# Altium schematic sheet Motor.SchDoc
size A3; SheetNumber: 5; SheetTotal: 6
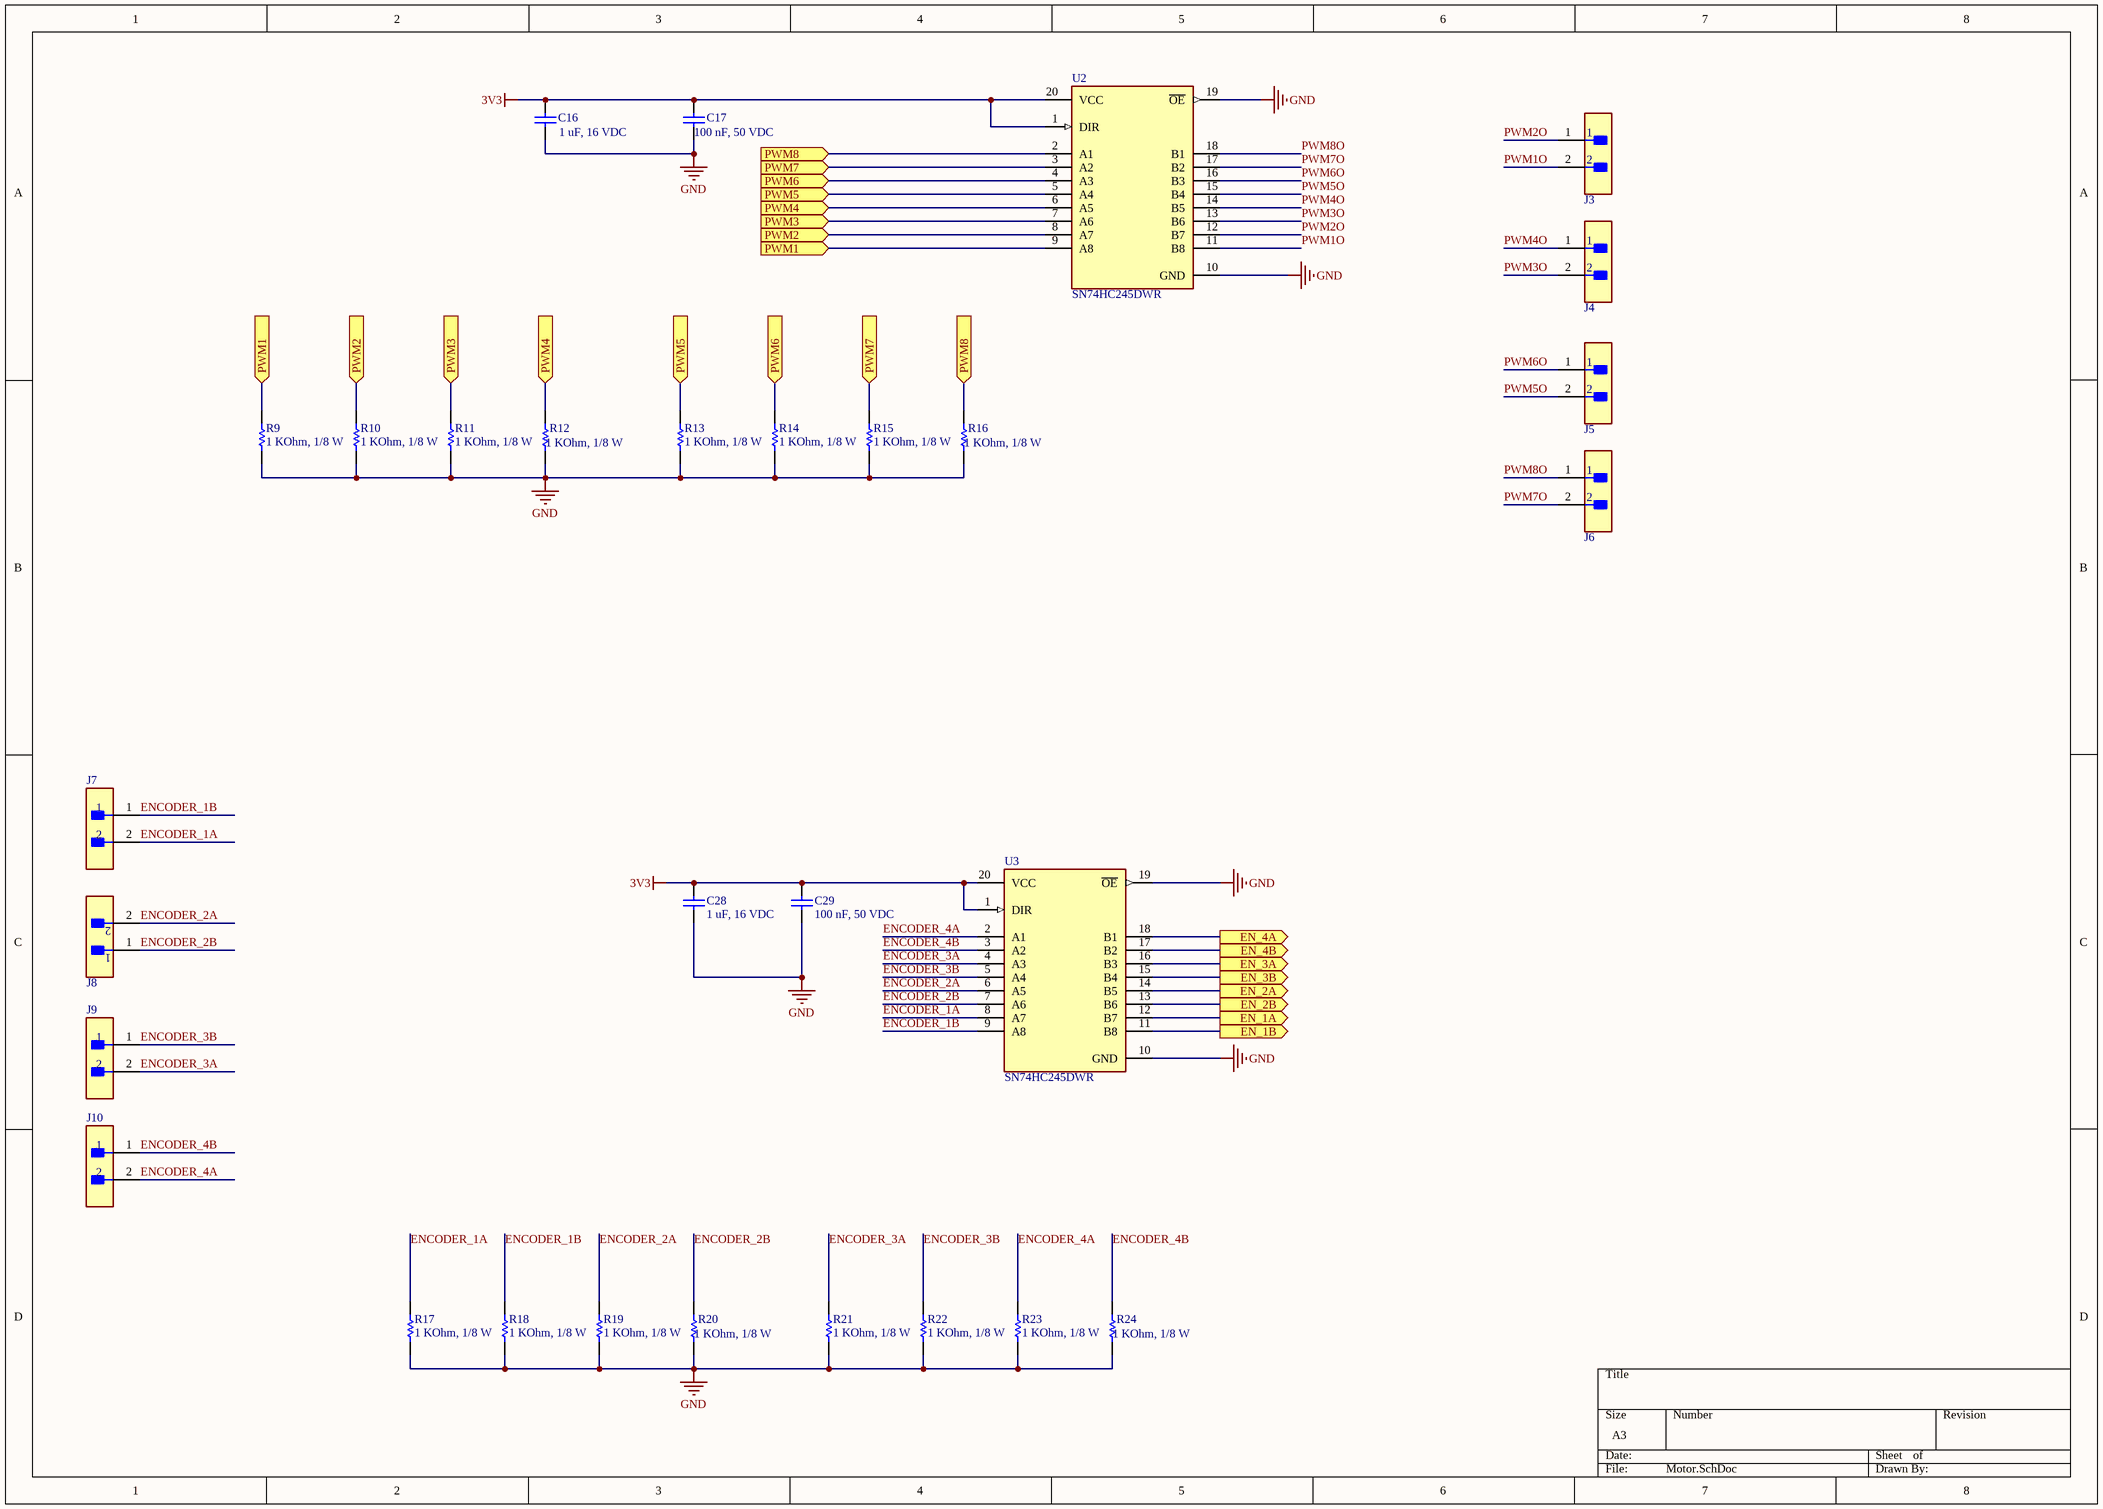
[diagram p0: Motor.SchDoc]

## Parts
C16  1 uF, 16 VDC  [CAP_0603]
C17  100 nF, 50 VDC  [CAP_0603]
C28  1 uF, 16 VDC  [CAP_0805]
C29  100 nF, 50 VDC  [CAP_0805]
J3  B2B-XH-A(LF)(SN)  [FP-B2B-XH-A_LF_SN-MFG]  (value not drawn)
J4  B2B-XH-A(LF)(SN)  [FP-B2B-XH-A_LF_SN-MFG]  (value not drawn)
J5  B2B-XH-A(LF)(SN)  [FP-B2B-XH-A_LF_SN-MFG]  (value not drawn)
J6  B2B-XH-A(LF)(SN)  [FP-B2B-XH-A_LF_SN-MFG]  (value not drawn)
J7  B2B-XH-A(LF)(SN)  [FP-B2B-XH-A_LF_SN-MFG]  (value not drawn)
J8  B2B-XH-A(LF)(SN)  [FP-B2B-XH-A_LF_SN-MFG]  (value not drawn)
J9  B2B-XH-A(LF)(SN)  [FP-B2B-XH-A_LF_SN-MFG]  (value not drawn)
J10  B2B-XH-A(LF)(SN)  [FP-B2B-XH-A_LF_SN-MFG]  (value not drawn)
R9  1 KOhm, 1/8 W  [RESISTOR_0805]
R10  1 KOhm, 1/8 W  [RESISTOR_0805]
R11  1 KOhm, 1/8 W  [RESISTOR_0805]
R12  1 KOhm, 1/8 W  [RESISTOR_0805]
R13  1 KOhm, 1/8 W  [RESISTOR_0805]
R14  1 KOhm, 1/8 W  [RESISTOR_0805]
R15  1 KOhm, 1/8 W  [RESISTOR_0805]
R16  1 KOhm, 1/8 W  [RESISTOR_0805]
R17  1 KOhm, 1/8 W  [RESISTOR_0805]
R18  1 KOhm, 1/8 W  [RESISTOR_0805]
R19  1 KOhm, 1/8 W  [RESISTOR_0805]
R20  1 KOhm, 1/8 W  [RESISTOR_0805]
R21  1 KOhm, 1/8 W  [RESISTOR_0805]
R22  1 KOhm, 1/8 W  [RESISTOR_0805]
R23  1 KOhm, 1/8 W  [RESISTOR_0805]
R24  1 KOhm, 1/8 W  [RESISTOR_0805]
U2  SN74HC245DWR  [FP-DW0020A-IPC_A]
U3  SN74HC245DWR  [FP-DW0020A-IPC_A]

## Ports
EN_1A (out, see MCU[2C]), EN_1B (out, see MCU[2C]), EN_2A (out, see MCU[2A]), EN_2B (out, see MCU[2A]), EN_3A (out, see MCU[2A]), EN_3B (out, see MCU[4A]), EN_4A (out, see MCU[2A]), EN_4B (out, see MCU[2A]), PWM1 (in, see MCU[4B], Motor[1B]), PWM1 (in, see MCU[4B], Motor[3A]), PWM2 (in, see MCU[4B], Motor[2B]), PWM2 (in, see MCU[4B], Motor[3A]), PWM3 (in, see MCU[4B], Motor[2B]), PWM3 (in, see MCU[4B], Motor[3A]), PWM4 (in, see MCU[4B], Motor[3A]), PWM4 (in, see MCU[4B], Motor[3B]), PWM5 (in, see MCU[2B], Motor[3A]), PWM5 (in, see MCU[2B], Motor[3B]), PWM6 (in, see MCU[2B], Motor[3A]), PWM6 (in, see MCU[2B], Motor[3B]), PWM7 (in, see MCU[2B], Motor[3A]), PWM7 (in, see MCU[2B], Motor[4B]), PWM8 (in, see MCU[2B], Motor[3A]), PWM8 (in, see MCU[2B], Motor[4B])

## Nets
3V3: C16.2 C17.2 C28.2 C29.2 U2.1(DIR) U2.20(VCC) U3.1(DIR) U3.20(VCC)
GND: C16.1 C17.1 C28.1 C29.1 R9.1 R10.1 R11.1 R12.1 R13.1 R14.1 R15.1 R16.1 R17.1 R18.1 R19.1 R20.1 R21.1 R22.1 R23.1 R24.1 U2.10(GND) U2.19(~{OE}) U3.10(GND) U3.19(~{OE})
EN_1A: U3.12(B7) ; port EN_1A
EN_1B: U3.11(B8) ; port EN_1B
EN_2A: U3.14(B5) ; port EN_2A
EN_2B: U3.13(B6) ; port EN_2B
EN_3A: U3.16(B3) ; port EN_3A
EN_3B: U3.15(B4) ; port EN_3B
EN_4A: U3.18(B1) ; port EN_4A
EN_4B: U3.17(B2) ; port EN_4B
ENCODER_1A: J7.2 R17.2 U3.8(A7)
ENCODER_1B: J7.1 R18.2 U3.9(A8)
ENCODER_2A: J8.2 R19.2 U3.6(A5)
ENCODER_2B: J8.1 R20.2 U3.7(A6)
ENCODER_3A: J9.2 R21.2 U3.4(A3)
ENCODER_3B: J9.1 R22.2 U3.5(A4)
ENCODER_4A: J10.2 R23.2 U3.2(A1)
ENCODER_4B: J10.1 R24.2 U3.3(A2)
PWM1: R9.2 U2.9(A8) ; port PWM1
PWM1O: J3.2 U2.11(B8)
PWM2: R10.2 U2.8(A7) ; port PWM2
PWM2O: J3.1 U2.12(B7)
PWM3: R11.2 U2.7(A6) ; port PWM3
PWM3O: J4.2 U2.13(B6)
PWM4: R12.2 U2.6(A5) ; port PWM4
PWM4O: J4.1 U2.14(B5)
PWM5: R13.2 U2.5(A4) ; port PWM5
PWM5O: J5.2 U2.15(B4)
PWM6: R14.2 U2.4(A3) ; port PWM6
PWM6O: J5.1 U2.16(B3)
PWM7: R15.2 U2.3(A2) ; port PWM7
PWM7O: J6.2 U2.17(B2)
PWM8: R16.2 U2.2(A1) ; port PWM8
PWM8O: J6.1 U2.18(B1)

## Library data of the parts
C16 = 0106031051016: CAP, size 0603, 1 uF, 16 VDC; Manufacture Name: Samsung Electro-Mechanics; Manufacture SN: CL10B105KO8NNWC; Capacitance: 1 uF; Tolerance: +/-10%; Voltage Rating DC: 16 VDC; ComponentLink2Description: Datasheet; ComponentLink2URL: https://www.mouser.vn/datasheet/2/585/Samsung_MLCC_1837944-1929650.pdf; Operating Temperature: -55 to +125degC; Packaging: Tape and Reel; Mounting Technology: SMT; Size: 0603; Supplier 1 Name: Mouser; Supplier 1 SN: 187-CL10B105KO8NNWC; Supplier 1 URL: https://www.mouser.vn/ProductDetail/Samsung-Electro-Mechanics/CL10B105KO8NNWC?qs=81r%252BiQLm7BT%252BXtc72qn1ug%3D%3D&utm_source=mouser-refine-download&utm_medium=file&utm_campaign=CL10B105KO8NNWC&utm_content=Samsung-Electro-Mechanics; Supplier 2 Name: Digi-Key; Supplier 2 SN: 1276-CL10B105KO8NNWCTR-ND; Supplier 2 URL: https://www.digikey.com/en/products/detail/samsung-electro-mechanics/cl10b105ko8nnwc/16572783; Supplier 3 Name: thegioiic; Supplier 3 SN: N/A; Supplier 3 URL: https://www.thegioiic.com/tu-gom-0603-1uf-16v; Value: 1 uF, 16 VDC
C17 = 0106031041050: CAP, size 0603, 100 nF, 50 VDC; Manufacture Name: TDK; Manufacture SN: CGA3E3X8R1H104K080AE; Capacitance: 100 nF; Tolerance: +/-10%; Voltage Rating DC: 50 VDC; ComponentLink2Description: Datasheet; ComponentLink2URL: https://product.tdk.com/system/files/dam/doc/product/capacitor/ceramic/mlcc/catalog/mlcc_automotive_soft_en.pdf?ref_disty=mouser; Operating Temperature: -55 to +125degC; Packaging: Tape and Reel; Mounting Technology: SMT; Size: 0603; Supplier 1 Name: Mouser; Supplier 1 SN: 810-CGA3E3X8R1H104KA; Supplier 1 URL: https://www.mouser.com/ProductDetail/TDK/CGA3E3X8R1H104K080AE?qs=nQSIdc08i%252Bd8g3IRRgU2bw%3D%3D&utm_source=mouser-refine-download&utm_medium=file&utm_campaign=CGA3E3X8R1H104K080AE&utm_content=TDK; Supplier 2 Name: Digi-Key; Supplier 2 SN: 445-173697-2-ND; Supplier 2 URL: https://www.digikey.com/en/products/detail/tdk-corporation/cga3e3x8r1h104k080ae/5809262; Supplier 3 Name: thegioiic; Supplier 3 SN: N/A; Supplier 3 URL: N/A; Value: 100 nF, 50 VDC
C28 = 0108051051016: CAP, size 0805, 1 uF, 16 VDC; Manufacture Name: TDK; Manufacture SN: CGA4J2X7R1C105K125AA; Capacitance: 1 uF; Tolerance: +/-10%; Voltage Rating DC: 16 VDC; ComponentLink2Description: Datasheet; ComponentLink2URL: https://product.tdk.com/system/files/dam/doc/product/capacitor/ceramic/mlcc/catalog/mlcc_automotive_general_en.pdf?ref_disty=mouser; Operating Temperature: -55 to +125degC; Packaging: Tape and Reel; Mounting Technology: SMT; Size: 0805; Supplier 1 Name: Mouser; Supplier 1 SN: 810-CGA4J2X7R1C105K; Supplier 1 URL: https://www.mouser.vn/ProductDetail/TDK/CGA4J2X7R1C105K125AA?qs=NRhsANhppD8sFjo%252B1TQuCQ%3D%3D&utm_source=mouser-refine-download&utm_medium=file&utm_campaign=CGA4J2X7R1C105K125AA&utm_content=TDK; Supplier 2 Name: Digi-Key; Supplier 2 SN: 445-5689-2-ND; Supplier 2 URL: https://www.digikey.com/en/products/detail/tdk-corporation/cga4j2x7r1c105k125aa/2443167; Supplier 3 Name: thegioiic; Supplier 3 SN: OEM; Supplier 3 URL: N/A; Value: 1 uF, 16 VDC
C29 = 0108051031050: CAP, size 0805, 100 nF, 50 VDC; Manufacture Name: TDK; Manufacture SN: CGA4C2C0G1H103J060AA; Capacitance: 10 nF; Tolerance: +/-5%; Voltage Rating DC: 50 VDC; Value: 10 nF, 50 VDC; ComponentLink2Description: Datasheet; ComponentLink2URL: https://product.tdk.com/system/files/dam/doc/product/capacitor/ceramic/mlcc/catalog/mlcc_automotive_general_en.pdf?ref_disty=mouser; Operating Temperature: -55 to +125degC; Packaging: Tape and Reel; Mounting Technology: SMT; Size: 0805; Supplier 1 Name: Mouser; Supplier 1 SN: 810-CGA4C2C0G1H103J; Supplier 1 URL: https://www.mouser.vn/ProductDetail/TDK/CGA4C2C0G1H103J060AA?qs=FxQuwy19cyC9M6v0nMqjhA%3D%3D&utm_source=mouser-refine-download&utm_medium=file&utm_campaign=CGA4C2C0G1H103J060AA&utm_content=TDK; Supplier 2 Name: Digi-Key; Supplier 2 SN: 445-6947-2-ND; Supplier 2 URL: https://www.digikey.com/en/products/detail/tdk-corporation/cga4c2c0g1h103j060aa/2672840; Supplier 3 Name: thegioiic; Supplier 3 SN: OEM; Supplier 3 URL: N/A
J3-J10 = CMP-2000-05888-3: CONN HEADER VERT 2POS 2.5MM; Current Rating: 3A; Voltage Rating: 250V; Number of Contacts: 2; Contact Resistance: 20mR; Wire/Cable Gauge: 22AWG; Insulation Resistance: 1GR; Connector Type: Male Pin; Packaging: Bulk; Contact Material: Brass; Lead Free: Lead Free; Orientation: Straight; Contact Plating: Tin; Max Current Rating: 3A; Termination: Solder; Fastening Type: Detent; Depth: 5.75mm; Housing Material: Polyamide; REACH SVHC: No SVHC; Series: XH; Voltage Rating (AC): 250V; Number of Positions: 2; Color: Natural; Contact Type: Male Pin; Max Voltage Rating (DC): 250V; Pitch: 2.5mm; Lead Pitch: 2.5mm; Mount: Through Hole; Max Operating Temperature: 85°C; Length: 7.4mm; Max Voltage Rating (AC): 250V; Min Operating Temperature: -25°C; Number of Rows: 1; Housing Color: White
R9-R24 = 0008051021: RES, size 0805, 1 KOhm, 1/8 W; Manufacture  Name: Vishay Dale; Manufacture  SN: M55342K06B1E00RS3; Resistance tolerance: +/-1%; Rated Power: 1/8 W; Resistance: 1 KOhm; Size: 0805; Mounting Technology: SMT; Supplier 1 Name: Mouser; Supplier 1 SN: N/A; Supplier 1 URL: N/A; Supplier 2 Name: Digi-Key; Supplier 2 SN: 1135-1001-2-ND; Supplier 2 URL: https://www.digikey.com/en/products/detail/vishay-dale/M55342K06B1E00RS3/2941798; Supplier 3 Name: Thegioiic; Supplier 3 SN: N/A; Supplier 3 URL: https://www.thegioiic.com/dien-tro-1-kohm-0805-1; Value: 1 KOhm, 1/8 W; ComponentLink1Description: Datasheet link; ComponentLink1URL: https://www.vishay.com/docs/31010/rcwpm.pdf; ComponentLink2Description: Supplier 1 URL; ComponentLink2URL: N/A; ComponentLink3Description: Supplier 2 URL; ComponentLink3URL: https://www.digikey.com/en/products/detail/vishay-dale/M55342K06B1E00RS3/2941798; ComponentLink4Description: Supplier 3 URL; ComponentLink4URL: https://www.thegioiic.com/dien-tro-1-kohm-0805-1
U2 U3 = CMP-1620-00193-3: IC TRANSCVR NON-INVERT 6V 20SOIC; Logic Function: Transceiver; Number of Circuits: 8; High Level Output Current: -7.8mA; Min Supply Voltage: 2V; Direction: Bidirectional; Propagation Delay: 335ns; Number of Elements: 1; Operating Supply Voltage: 5V; Polarity: Non-Inverting; Quiescent Current: 8uA; Low Level Output Current: 7.8mA; Number of Channels: 8; Width: 7.52mm; Length: 12.8mm; Case/Package: SOIC; Lead Free: Lead Free; Max Supply Voltage: 6V; Max Operating Temperature: 85°C; Mount: Surface Mount; Weight: 0.017662oz; Height: 2.35mm; Contact Plating: Gold; Package Quantity: 1; RoHS Compliant: Yes; Min Operating Temperature: -40°C; Packaging: Tape and Reel; Number of Bits per Element: 8; Number of Outputs: 8; Number of Bits: 8; Number of Pins: 20; REACH SVHC: No SVHC; Turn-On Delay Time: 335ns; Radiation Hardening: No